# EAGLE design tester (EAGLE 6.4)
COPYRIGHT: based on Transistortester (microcontroller.net); PROJECT_INFO: +backlight-pwm +zener +relais; PROJECT_NAME: Component Tester
Assembly variants: nopwm
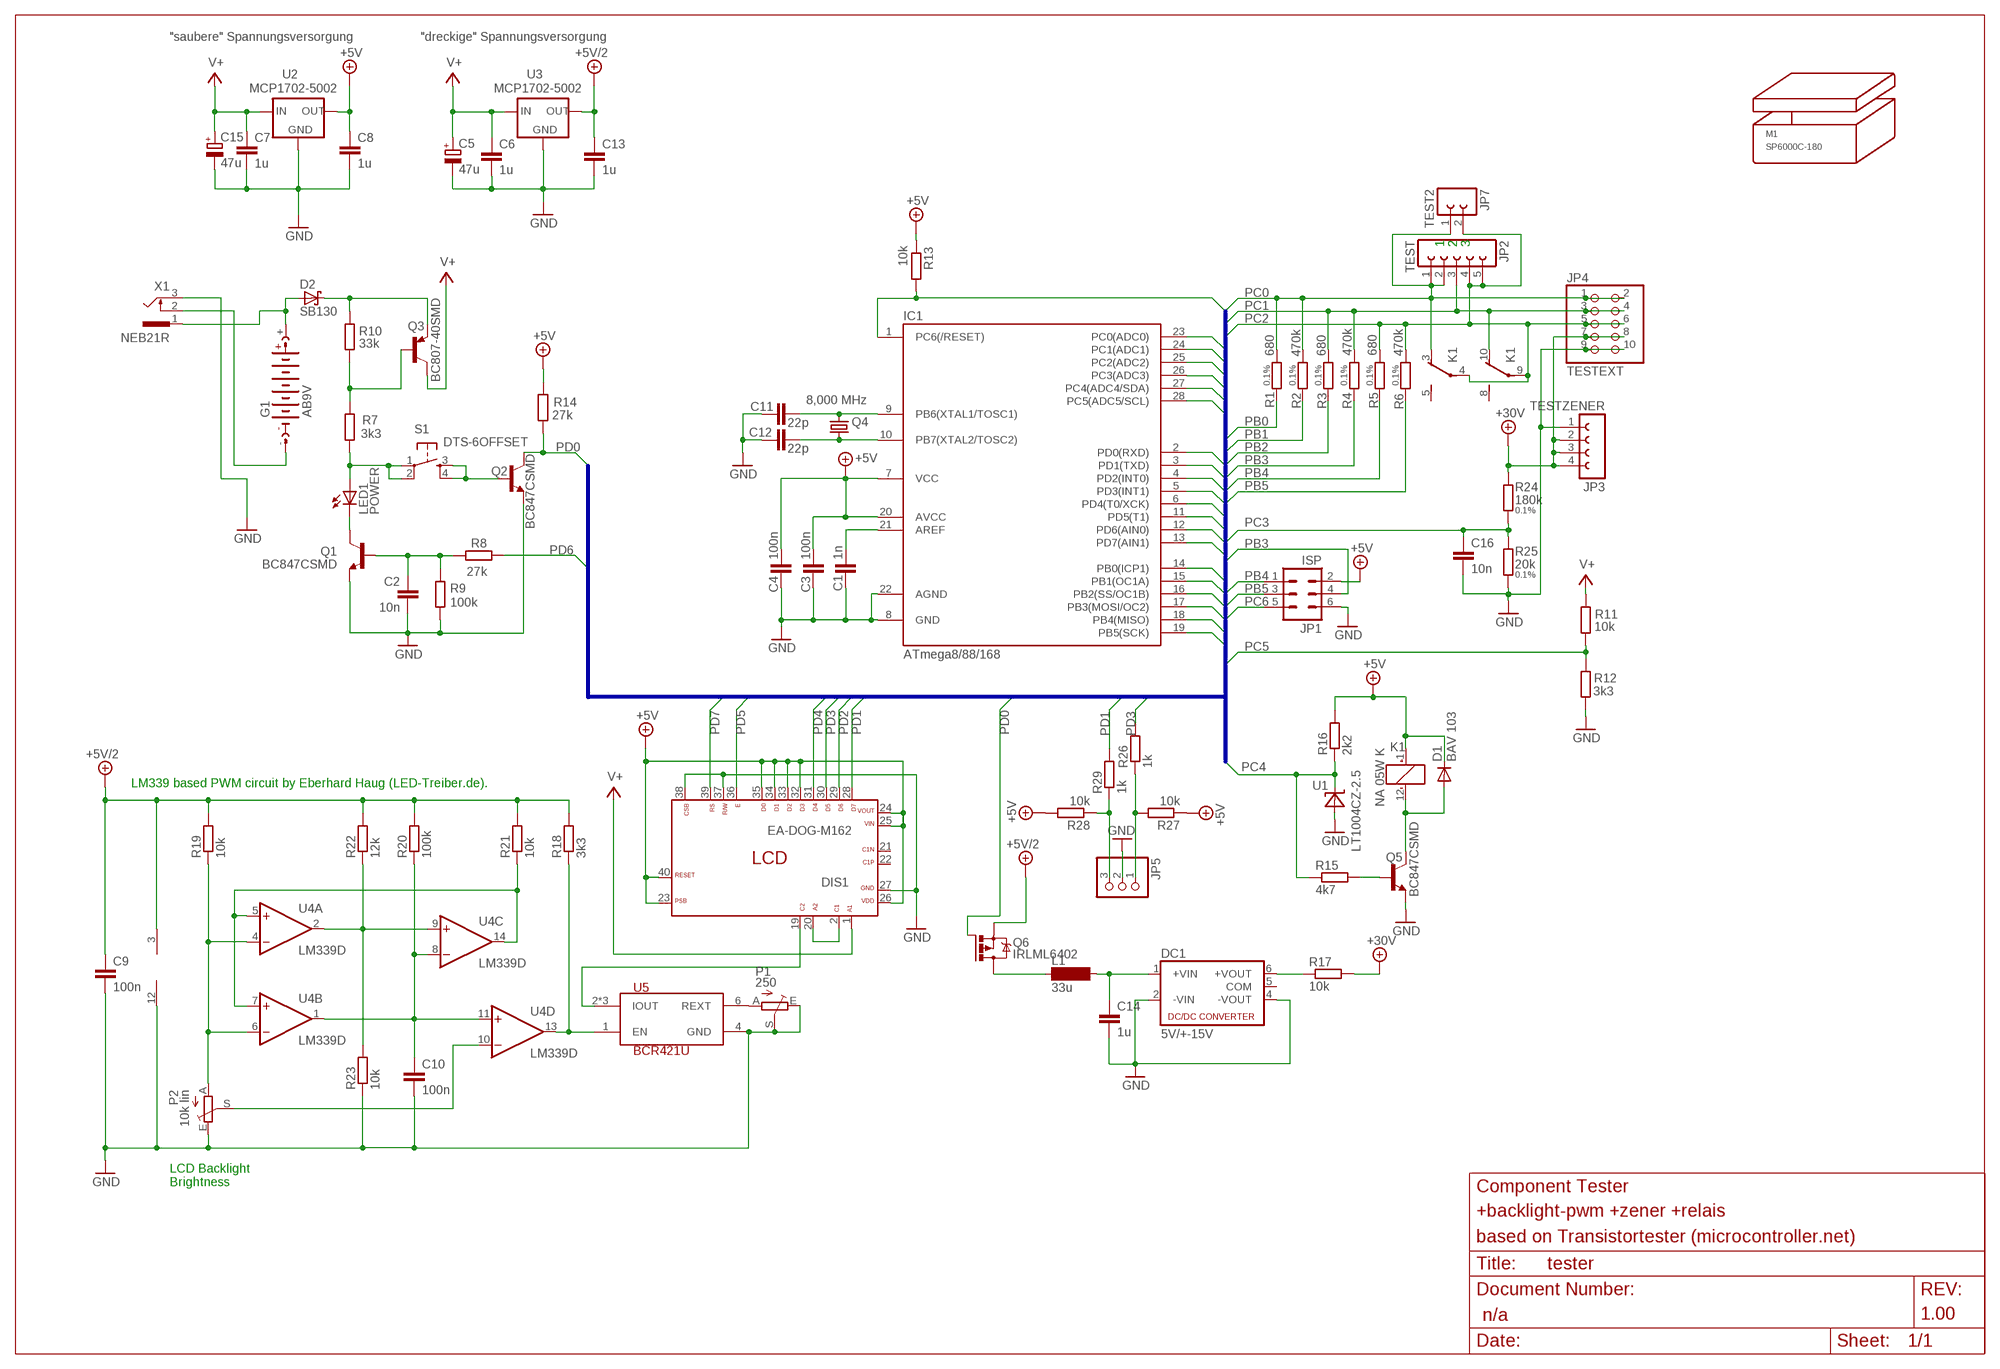
[diagram p0: schematic, sheet 1]
FRAME1 (FRAME_A3): DOCUMENT_ID: n/a; REVISION_ID: 1.00

## Parts
C1  1n  C-EUC0805  [C0805]
C2  10n  C-EUC0805  [C0805]
C3  100n  C-EUC0805  [C0805]
C4  100n  C-EUC0805  [C0805]
C5  47u  CPOL-EU153CLV-0505  [153CLV-0505]
C6  1u  C-EUC0805  [C0805]
C7  1u  C-EUC0805  [C0805]
C8  1u  C-EUC0805  [C0805]
C9  100n  C-EUC0805  [C0805]  (not fitted in variant nopwm)
C10  100n  C-EUC0805  [C0805]  (not fitted in variant nopwm)
C11  22p  C-EUC0805  [C0805]
C12  22p  C-EUC0805  [C0805]
C13  1u  C-EUC0805  [C0805]
C14  1u  C-EUC0805  [C0805]
C15  47u  CPOL-EU153CLV-0505  [153CLV-0505]
C16  10n  C-EUC0805  [C0805]
D1  BAV 103  DIODE-SOD80C  [SOD80C]
D2  SB130  SCHOTTKY-DIODE_RAD3-5-A  [DIODE-3-5A-V]
DC1  5V/+-15V  NMA  [NMA]
DIS1  EA-DOG-M162  EA-DOG-M_LCD  [EA_DOGM]
G1  AB9V  [AB9V]
IC1  ATmega8/88/168  MEGA8-PU  [DIL28-3]
JP1  ISP  ML6  [ML6]
JP2  TEST  FE05-1  [FE05-1]
JP3  TESTZENER  FE04-1  [FE04-1]
JP4  TESTEXT  PINHD-2X5  [2X05]
JP5  PINHD-1X3  [1X03]
JP7  TEST2  FE02-1  [FE02-1]
K1  NA 05W K  NA  [NA]
L1  33u  SM-NE29BIGGERPAD  [SM-NE29-B]
LED1  POWER  LED5MMEXT  [LED5MM]
M1  SP6000C-180  [SP6000C-180]
P1  250  TRIM_EU-CA6H  [CA6H]
P2  10k lin  TRIM_EU-CA9V  [CA9V]  (not fitted in variant nopwm)
Q1  BC847CSMD  [SOT23]
Q2  BC847CSMD  [SOT23]
Q3  BC807-40SMD  [SOT23-BEC]
Q4  8,000 MHz  CRYSTALHC49S  [HC49/S]
Q5  BC847CSMD  [SOT23]
Q6  IRLML6402  [MICRO3]
R1  680  R-EU_R0805  [R0805]
R2  470k  R-EU_R0805  [R0805]
R3  680  R-EU_R0805  [R0805]
R4  470k  R-EU_R0805  [R0805]
R5  680  R-EU_R0805  [R0805]
R6  470k  R-EU_R0805  [R0805]
R7  3k3  R-EU_R0805  [R0805]
R8  27k  R-EU_R0805  [R0805]
R9  100k  R-EU_R0805  [R0805]
R10  33k  R-EU_R0805  [R0805]
R11  10k  R-EU_R0805  [R0805]
R12  3k3  R-EU_R0805  [R0805]
R13  10k  R-EU_R0805  [R0805]
R14  27k  R-EU_R0805  [R0805]
R15  4k7  R-EU_R0805  [R0805]
R16  2k2  R-EU_R0805  [R0805]
R17  10k  R-EU_R0805  [R0805]
R18  3k3  R-EU_R0805  [R0805]
R19  10k  R-EU_R0805  [R0805]  (not fitted in variant nopwm)
R20  100k  R-EU_R0805  [R0805]  (not fitted in variant nopwm)
R21  10k  R-EU_R0805  [R0805]  (not fitted in variant nopwm)
R22  12k  R-EU_R0805  [R0805]  (not fitted in variant nopwm)
R23  10k  R-EU_R0805  [R0805]  (not fitted in variant nopwm)
R24  180k  R-EU_R0805  [R0805]
R25  20k  R-EU_R0805  [R0805]
R26  1k  R-EU_R0805  [R0805]
R27  10k  R-EU_R0805  [R0805]
R28  10k  R-EU_R0805  [R0805]
R29  1k  R-EU_R0805  [R0805]
S1  DTS-6OFFSET  [DTS-6S]
U1  LT1004CZ-2.5  LM329DZ  [TO92]
U2  MCP1702-5002  [TO92-LOWDROP]
U3  MCP1702-5002  [TO92-LOWDROP]
U4  LM339D  [SO14]  (not fitted in variant nopwm)
U5  BCR421U  BCR421UHAND  [SC74_INFINEON]
X1  NEB21R  [NEB21R]

## Nets
+5V: C3.2 C4.1 C8.1 D1.C DIS1.23 DIS1.24 DIS1.25 DIS1.26 DIS1.32 DIS1.33 DIS1.34 DIS1.35 DIS1.40 IC1.7(VCC) IC1.20(AVCC) JP1.2 K1.1(1:+) R13.1 R14.2 R16.2 R27.1 R28.2 U2.OUT
+5V/2: C9.1 C13.1 Q6.2(S) R18.2 R19.2 R20.2 R21.2 R22.2 U3.OUT U4.3(P:V+)
+30V: JP3.2 JP3.3 JP3.4 JP4.7 JP4.8 R17.2 R24.2
AREF: C1.2 IC1.21(AREF)
GND: C1.1 C2.2 C3.1 C4.2 C5.- C6.2 C7.2 C8.2 C9.2 C10.2 C11.1 C12.1 C13.2 C14.2 C15.- C16.2 DC1.2(-VIN) DC1.4(-VOUT) DIS1.27 DIS1.37 DIS1.38 IC1.8(GND) IC1.22(AGND) JP1.6 JP3.1 JP4.9 JP4.10 JP5.2 P1.E P1.S P2.E Q1.2(E) Q2.2(E) Q5.2(E) R9.1 R12.1 R23.1 R25.1 U1.1(A) U2.GND U3.GND U4.12(P:GND) U5.4(GND) X1.3
N$1: P1.A U5.6(REXT)
N$2: DIS1.2 DIS1.20
N$3: Q2.1(B) S1.3 S1.4
N$4: R22.1 R23.2 U4.2(A:OUT) U4.9(C:+IN)
N$5 [pwr]: G1.- X1.2
N$6: C10.1 R20.1 U4.1(B:OUT) U4.8(C:-IN) U4.11(D:+IN)
N$7: R21.1 U4.5(A:+IN) U4.7(B:+IN) U4.14(C:OUT)
N$8: LED1.K(C) Q1.3(C)
N$9 [pwr]: D2.C Q3.E R10.1
N$10: DIS1.19 U5.2(IOUT) U5.3(IOUT) U5.5(IOUT)
N$12: C11.2 IC1.9(PB6(XTAL1/TOSC1)) Q4.2
N$13: C12.2 IC1.10(PB7(XTAL2/TOSC2)) Q4.1
N$14: JP5.3 R28.1 R29.1
N$15: P2.A R19.1 U4.4(A:-IN) U4.6(B:-IN)
N$16: P2.S U4.10(D:-IN)
N$17: R18.1 U4.13(D:OUT) U5.1(EN)
N$18: D1.A K1.12(1:-) Q5.3(C)
N$19: JP5.1 R26.1 R27.2
N$21: LED1.A R7.1 S1.1 S1.2
N$22: Q5.1(B) R15.2
N$23 [pwr]: D2.A G1.+ X1.1
N$24: L1.1 Q6.3(D)
N$25: C14.1 DC1.1(+VIN) L1.2
N$28: DC1.6(+VOUT) R17.1
N$33: Q3.B R7.2 R10.2
N$35: C2.1 Q1.1(B) R8.2 R9.2
PB0: IC1.14(PB0(ICP1)) R1.1
PB1: IC1.15(PB1(OC1A)) R2.1
PB2: IC1.16(PB2(SS/OC1B)) R3.1
PB3: IC1.17(PB3(MOSI/OC2)) JP1.4 R4.1
PB4: IC1.18(PB4(MISO)) JP1.1 R5.1
PB5: IC1.19(PB5(SCK)) JP1.3 R6.1
PC0: IC1.23(PC0(ADC0)) JP2.1 JP2.2 JP4.1 JP4.2 JP7.1 K1.3(2:O) R1.2 R2.2
PC1: IC1.24(PC1(ADC1)) JP2.3 JP4.3 JP4.4 K1.10(3:O) R3.2 R4.2
PC2: IC1.25(PC2(ADC2)) JP2.4 JP2.5 JP4.5 JP4.6 JP7.2 K1.4(2:P) K1.9(3:P) R5.2 R6.2
PC3: C16.1 IC1.26(PC3(ADC3)) R24.1 R25.2
PC4: IC1.27(PC4(ADC4/SDA)) R15.1 R16.1 U1.2(C)
PC5: IC1.28(PC5(ADC5/SCL)) R11.2 R12.2
PC6: IC1.1(PC6(/RESET)) JP1.5 R13.2
PD0: IC1.2(PD0(RXD)) Q2.3(C) Q6.1(G) R14.1
PD1: DIS1.28 IC1.3(PD1(TXD)) R29.2
PD2: DIS1.29 IC1.4(PD2(INT0))
PD3: DIS1.30 IC1.5(PD3(INT1)) R26.2
PD4: DIS1.31 IC1.6(PD4(T0/XCK))
PD5: DIS1.36 IC1.11(PD5(T1))
PD6: IC1.12(PD6(AIN0)) R8.1
PD7: DIS1.39 IC1.13(PD7(AIN1))
V+ [pwr]: C5.+ C6.1 C7.1 C15.+ DIS1.1 Q3.C R11.1 U2.IN U3.IN
Unconnected: DC1.5(COM) DIS1.21 DIS1.22 K1.5(2:S) K1.8(3:S)

## Buses
BUS1:PB[0..5],PC[0..6],PD[0..7]

## Notes on the sheet
- "saubere" Spannungsversorgung | "dreckige" Spannungsversorgung
- 1 | 2 | 3
- LM339 based PWM circuit by Eberhard Haug (LED-Treiber.de).
- LCD Backlight
  Brightness

## Library data of the parts
C1-C4 C6-C14 C16 = rcl:C-EU: CAPACITOR, European symbol
C5 C15 = rcl:CPOL-EU: POLARIZED CAPACITOR, European symbol
D1 = diode:DIODE-: DIODE
D2 = markus:SCHOTTKY-DIODE: Schottky Diode
DC1 = dc-dc-converter:NMA: DC-DC CONVERTER; MF: C & D TECHNOLOGIES, INC; MPN: NMA0515SC; OC_FARNELL: 1021434; OC_NEWARK: 61K3064
DIS1 = ea:EA-DOG-M_LCD
G1 = battery:AB9V: 9-V BATTERY CLIP
IC1 = avr-7:MEGA8-PU
JP1 = con-ml:ML6: HARTING; OC_FARNELL: unknown; OC_NEWARK: unknown
JP2 = con-lsta:FE05-1: FEMALE HEADER; OC_FARNELL: unknown; OC_NEWARK: unknown
JP3 = con-lsta:FE04-1: FEMALE HEADER
JP4 = pinhead:PINHD-2X5: PIN HEADER; REICHELT: AW 226/20
JP5 = pinhead:PINHD-1X3: PIN HEADER
JP7 = con-lsta:FE02-1: FEMALE HEADER
K1 = relay:NA: RELAY; OC_FARNELL: unknown; OC_NEWARK: unknown
L1 = inductor-neosid:SM-NE29: INDUCTOR SMD chip inductor
LED1 = led:LED: LED OSRAM: - CHIPLED LG R971, LG N971, LY N971, LG Q971, LY Q971, LO R971, LY R971 LH N974, LH R974 LS Q976, LO Q976, LY Q976 LO Q996 - Hyper CHIPLED LW Q18S LB Q993, LB Q99A, LB R99A - SideLED LS A670, LO A670, LY A670, LG A670, LP A670 LB A673, LV A673, LT A673, LW A673 LH A674 LY A675 LS A676, LA A676, LO A676, LY A676, LW A676 LS A679, LY A679, LG A679 - Hyper Micro SIDELED® LS Y876, LA Y876, LO Y876, LY Y876 LT Y87S - SmartLED LW L88C, LW L88S LB L89C, LB L89S, LG L890 LS L89K, LO L89K, LY L89K LS L896, LA L896, LO L896, LY L896 - TOPLED LS T670, LO T670, LY T670, LG T670, LP T670 LSG T670, LSP T670, LSY T670, LOP T670, LYG T670 LG T671, LOG T671, LSG T671 LB T673, LV T673, LT T673, LW T673 LH T674 LS T676, LA T676, LO T676, LY T676, LB T676, LH T676, LSB T676, LW T676 LB T67C, LV T67C, LT T67C, LS T67K, LO T67K, LY T67K, LW E67C LS E67B, LA E67B, LO E67B, LY E67B, LB E67C, LV E67C, LT E67C LW T67C LS T679, LY T679, LG T679 LS T770, LO T770, LY T770, LG T770, LP T770 LB T773, LV T773, LT T773, LW T773 LH T774 LS E675, LA E675, LY E675, LS T675 LS T776, LA T776, LO T776, LY T776, LB T776 LHGB T686 LT T68C, LB T68C - Hyper Mini TOPLED® LB M676 - Mini TOPLED Santana® LG M470 LS M47K, LO M47K, LY M47K Source: http://www.osram.convergy.de LUXEON: - LUMILED® LXK2-PW12-R00, LXK2-PW12-S00, LXK2-PW14-U00, LXK2-PW14-V00 LXK2-PM12-R00, LXK2-PM12-S00, LXK2-PM14-U00 LXK2-PE12-Q00, LXK2-PE12-R00, LXK2-PE12-S00, LXK2-PE14-T00, LXK2-PE14-U00 LXK2-PB12-K00, LXK2-PB12-L00, LXK2-PB12-M00, LXK2-PB14-N00, LXK2-PB14-P00, LXK2-PB14-Q00 LXK2-PR12-L00, LXK2-PR12-M00, LXK2-PR14-Q00, LXK2-PR14-R00 LXK2-PD12-Q00, LXK2-PD12-R00, LXK2-PD12-S00 LXK2-PH12-R00, LXK2-PH12-S00 LXK2-PL12-P00, LXK2-PL12-Q00, LXK2-PL12-R00 Source: www.luxeon.com KINGBRIGHT: KA-3528ASYC Source: www.kingbright.com; _EXTERNAL_: ext. package
M1 = strapubox:SP6000: Gehäuse Strapubox Typ 6000 max. Bauteilhöhe, top-layer: 15,5 mm max. Bauteilhöhe, bottom-layer: 5 mm (Dicke der LP: 1,5 mm) Außenmaße: Länge: 103 mm Breite: 62 mm Höhe: 26 mm Innenmaße: Länge: 97 mm Breite: 56 mm Höhe: 22 mm Mit Batteriefach 2xAA/9V
P1 P2 = pot:TRIM_EU-: POTENTIOMETER
Q1 Q2 Q5 = transistor-npn:BC847*: NPN Transistor
Q3 = transistor-pnp:BC807*: PNP Transistror
Q4 = crystal:CRYSTAL: CRYSTAL; OC_FARNELL: 1667008; OC_NEWARK: unknown
Q6 = mosfet:IRLML6402: HEXFET P-Channel Power MOSFET http://www.irf.com/product-info/datasheets/data/irlml6402.pdf
R1-R6 R24 R25 = resistor:R-EU_: RESISTOR, European symbol; TOLERANCE: 0.1%
R7-R23 R26-R29 = resistor:R-EU_: RESISTOR, European symbol
S1 = switch-tact:DTS-6
U1 = reference:LM329*: National Semiconductor LM329 6.8V buried zener voltage reference
U2 U3 = asko:MCP1702-5002
U4 = linear:LM339: Low Power Low Offset Voltage Quad Comparators with open collector; LM139/LM239/LM339/LM2901/LM3302
U5 = c-infineon_v2:BCR421U: Constant current source: 10mA (without external resistor).
X1 = con-lumberg:NEB21R: Netzgeräte-Einbaukupplung abgewinkelte Ausführung mit Öffner Source: http://www.lumberg.com/Produkte/PDFs/NEB21R.pdf; MPN: NEB 21 R; OC_FARNELL: 1217037; OC_NEWARK: 97K6458

## Net classes
0 default: width 0.25 mm, drill 0.3 mm
1 pwr: width 0.406 mm

## Board
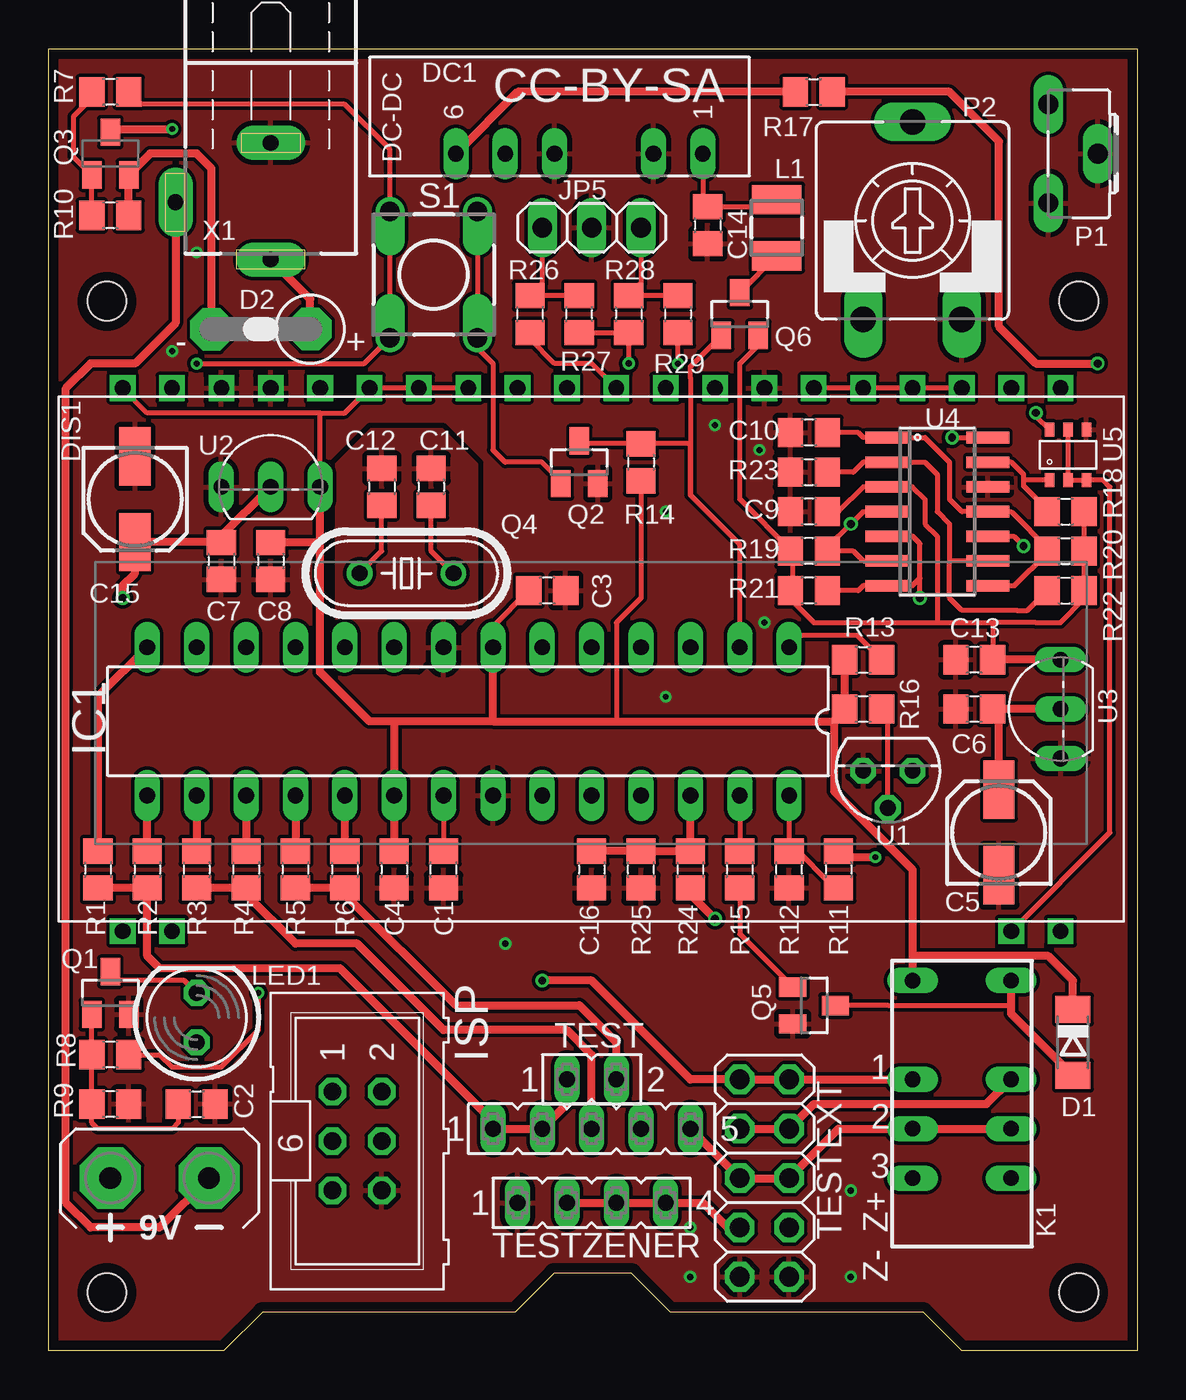
[diagram p1: board, top side]
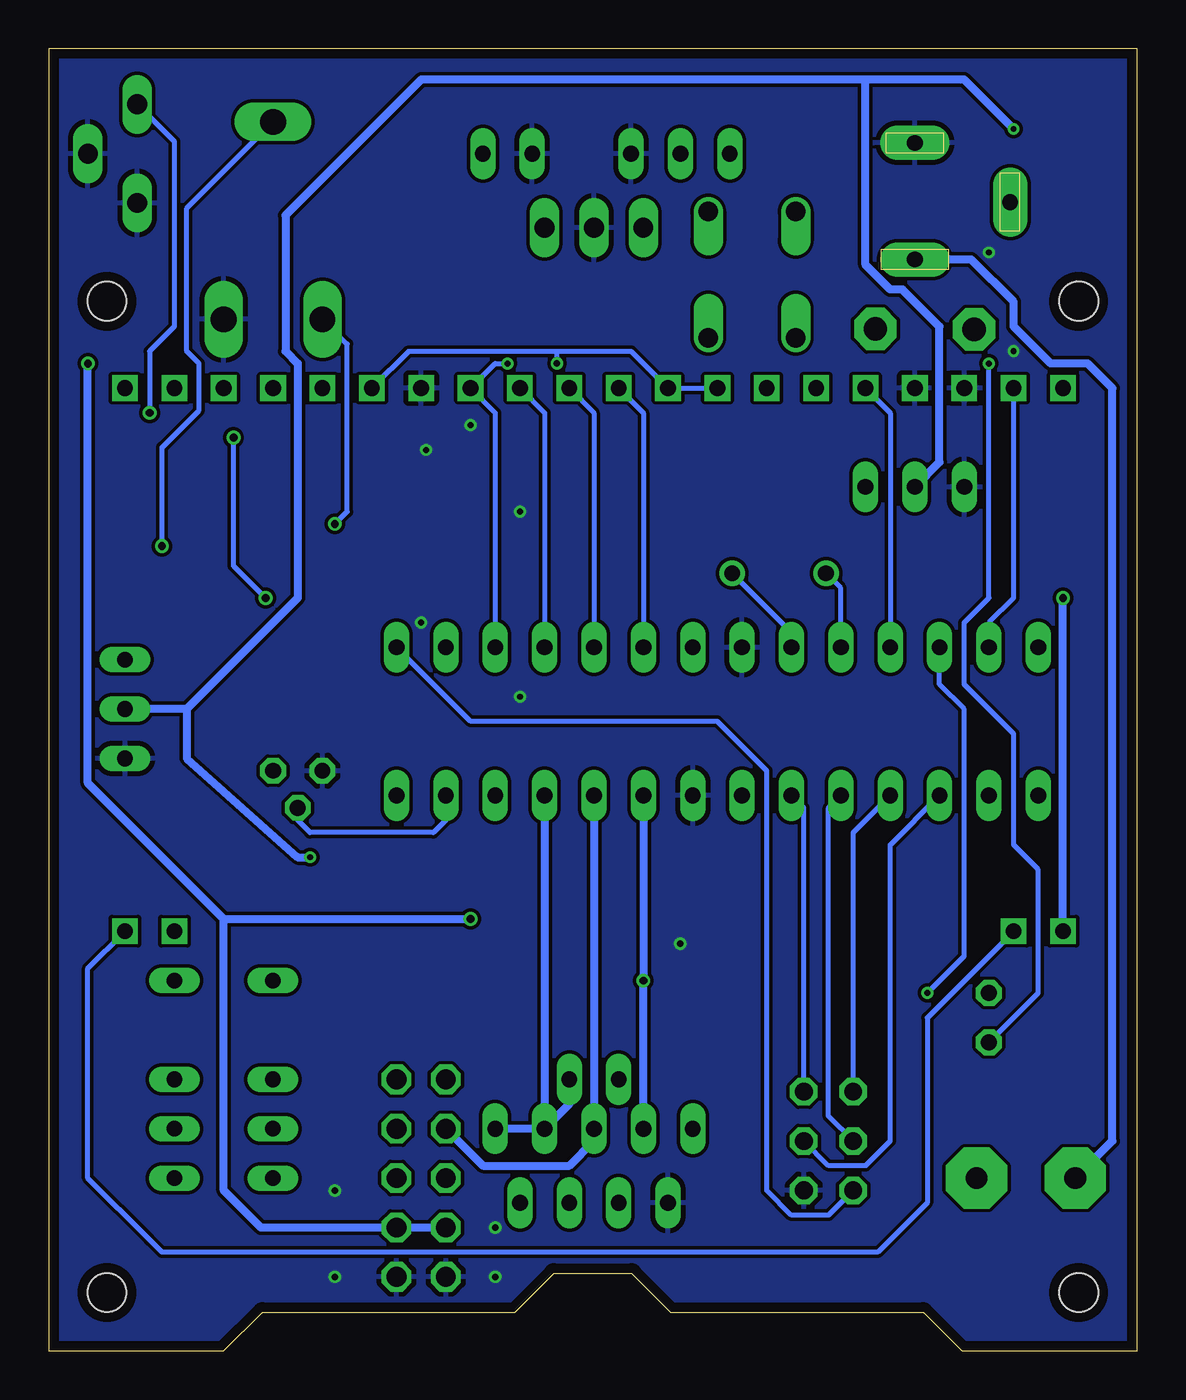
[diagram p2: board, bottom side, seen from below]

Size 56 x 67 mm. Coordinates in mm from the lower left corner, seen from the top.
Copper layers (1*16): Top 0.035mm / dielectric 1.5mm / Bottom 0.035mm
Design rules "smart-prototyping": minimum track width 7mil, minimum drill 12mil, track to track 7mil, track to pad 7mil, pad to pad 7mil, via to via 7mil, smd to smd 0mil, copper to edge 20mil, drill to drill 10mil, minimum pad ring 10mil, minimum via ring 6mil, stop-mask expansion 2mil, vias tented up to drill 25mil, thermal gap 10mil
tRestrict: area 52.8,46.9 to 53.1,47.7; area 51.8,47.8 to 53.2,47.9; area 50.7,44.3 to 54.4,44.4; area 51.1,45.2 to 52.2,45.3; area 52.7,45.2 to 53.9,45.3; 8 lines

### Footprints (pad centres in the part's own frame; a part is rotated, then mirrored left to right if it is on the bottom)
C0805 = smd 1.3 x 1.5: 1 -0.95,0; 2 0.95,0
153CLV-0505 = smd 3 x 1.6: + 2.2,0; - -2.2,0
SOD80C = smd 1.4 x 1.8: A 1.7,0; C -1.7,0
DIODE-3-5A-V = drill 1.2 pad 2.184 octagon: A -2.54,0; C 2.54,0.025
NMA = drill 0.813 long: 1 0,6.35; 2 0,3.81; 4 0,-1.27; 5 0,-3.81; 6 0,-6.35
EA_DOGM = drill 0.813 square: 1 0,0; 2 2.54,0; 19 45.72,0; 20 48.26,0; 21 48.26,27.94; 22 45.72,27.94; 23 43.18,27.94; 24 40.64,27.94; 25 38.1,27.94; 26 35.56,27.94; 27 33.02,27.94; 28 30.48,27.94; 29 27.94,27.94; 30 25.4,27.94; 31 22.86,27.94; 32 20.32,27.94; 33 17.78,27.94; 34 15.24,27.94; 35 12.7,27.94; 36 10.16,27.94; 37 7.62,27.94; 38 5.08,27.94; 39 2.54,27.94; 40 0,27.94
AB9V = drill 1.118 pad 3.15 octagon: + 0,2.54; - 0,-2.54
DIL28-3 = drill 0.813 long: 1 -16.51,-3.81; 2 -13.97,-3.81; 3 -11.43,-3.81; 4 -8.89,-3.81; 5 -6.35,-3.81; 6 -3.81,-3.81; 7 -1.27,-3.81; 8 1.27,-3.81; 9 3.81,-3.81; 10 6.35,-3.81; 11 8.89,-3.81; 12 11.43,-3.81; 13 13.97,-3.81; 14 16.51,-3.81; 15 16.51,3.81; 16 13.97,3.81; 17 11.43,3.81; 18 8.89,3.81; 19 6.35,3.81; 20 3.81,3.81; 21 1.27,3.81; 22 -1.27,3.81; 23 -3.81,3.81; 24 -6.35,3.81; 25 -8.89,3.81; 26 -11.43,3.81; 27 -13.97,3.81; 28 -16.51,3.81
ML6 = drill 0.914 octagon: 1 -2.54,-1.27; 2 -2.54,1.27; 3 0,-1.27; 4 0,1.27; 5 2.54,-1.27; 6 2.54,1.27
FE05-1 = drill 0.813 long: 1 -5.08,0; 2 -2.54,0; 3 0,0; 4 2.54,0; 5 5.08,0
FE04-1 = drill 0.813 long: 1 -3.81,0; 2 -1.27,0; 3 1.27,0; 4 3.81,0
2X05 = drill 1.016 octagon: 1 -5.08,-1.27; 2 -5.08,1.27; 3 -2.54,-1.27; 4 -2.54,1.27; 5 0,-1.27; 6 0,1.27; 7 2.54,-1.27; 8 2.54,1.27; 9 5.08,-1.27; 10 5.08,1.27
1X03 = drill 1.016 long: 1 -2.54,0; 2 0,0; 3 2.54,0
FE02-1 = drill 0.813 long: 1 -1.27,0; 2 1.27,0
NA = drill 0.8 long: 1 -6.35,-2.54; 3 -1.27,-2.54; 4 1.27,-2.54; 5 3.81,-2.54; 8 3.81,2.54; 9 1.27,2.54; 10 -1.27,2.54; 12 -6.35,2.54
SM-NE29-B = smd 1.5 x 2.54: 1 -1.45,0; 2 1.45,0
LED5MM = drill 0.813 octagon: A -1.27,0; K 1.27,0
SP6000C-180 = hole 2: 3,54; 53,54; 3,3; 53,3
CA6H = drill 1.016 long: A -2.54,0; E 2.54,0; S 0,2.54
CA9V = drill 1.321 long: A -2.54,-5.08; E 2.54,-5.08; S 0,5.08
SOT23 = smd 1 x 1.4: 1 -0.95,-1.1; 2 0.95,-1.1; 3 0,1.1
SOT23-BEC = smd 1 x 1.4: B -0.95,-1.1; C 0,1.1; E 0.95,-1.1
HC49/S = drill 0.813: 1 -2.413,0; 2 2.413,0
MICRO3 = smd 1 x 1.4: 1 -0.95,-1.1; 2 0.95,-1.1; 3 0,1.1
R0805 = smd 1.3 x 1.5: 1 -0.95,0; 2 0.95,0
DTS-6S = drill 1 offset: 1 -3.25,2.25; 2 3.25,2.25; 3 -3.25,-2.25; 4 3.25,-2.25
TO92 = drill 0.813 octagon: 1 1.27,0; 2 0,1.905; 3 -1.27,0
TO92-LOWDROP = drill 0.813 long: GND -3.81,0; IN -1.27,0; OUT 1.27,0
SO14 = smd 0.6 x 2.2: 1 -3.81,-2.6; 2 -2.54,-2.6; 3 -1.27,-2.6; 4 0,-2.6; 5 1.27,-2.6; 6 2.54,-2.6; 7 3.81,-2.6; 8 3.81,2.6; 9 2.54,2.6; 10 1.27,2.6; 11 0,2.6; 12 -1.27,2.6; 13 -2.54,2.6; 14 -3.81,2.6
SC74_INFINEON = smd 0.5 x 0.7: 1 -0.95,-1.3; 2 0,-1.3; 3 0.95,-1.3; 4 0.95,1.3; 5 0,1.3; 6 -0.95,1.3
NEB21R = drill 0.813 pad 1.778 long: 1 0,7.35; 2 4.9,4.4; 3 0,1.35

### Placement (x,y rotation side)
C1  20.32,24.77 90 top
C2  7.62,12.7 0 top
C3  25.65,39.12 180 top
C4  17.78,24.77 270 top
C5  48.9,26.67 90 top
C6  47.62,33.02 180 top
C7  8.89,40.64 270 top
C8  11.43,40.64 270 top
C9  39.12,43.18 180 top
C10  39.12,47.24 180 top
C11  19.68,44.45 270 top
C12  17.14,44.45 270 top
C13  47.62,35.56 180 top
C14  33.91,57.91 270 top
C15  4.45,43.81 270 top
C16  27.94,24.77 270 top
D1  52.7,15.88 270 top
D2  10.92,52.58 180 top
DC1  27.3,61.59 270 top
DIS1  3.81,21.59 0 top
G1  5.71,8.89 90 top
IC1  21.59,32.38 180 top
JP1  15.88,10.79 270 top
JP2  27.94,11.43 0 top
JP3  27.94,7.62 0 top
JP4  36.83,8.89 270 top
JP5  27.94,57.78 0 top
JP7  27.94,13.97 0 top
K1  46.99,12.7 270 top
L1  37.47,57.78 90 top
LED1  7.62,17.14 90 top
M1  0,0 0 top
P1  51.44,61.59 270 top
P2  44.45,58.15 0 top
Q1  3.17,18.41 0 top
Q2  27.3,45.72 0 top
Q3  3.17,61.59 0 top
Q4  18.41,40.01 0 top
Q5  39.39,17.77 270 top
Q6  35.56,53.34 0 top
R1  2.54,24.77 270 top
R2  5.08,24.77 270 top
R3  7.62,24.77 270 top
R4  10.16,24.77 270 top
R5  12.7,24.77 270 top
R6  15.24,24.77 270 top
R7  3.17,64.77 180 top
R8  3.17,15.24 180 top
R9  3.17,12.7 180 top
R10  3.17,58.42 180 top
R11  40.64,24.77 270 top
R12  38.1,24.77 90 top
R13  41.91,35.56 0 top
R14  30.48,45.72 270 top
R15  35.56,24.77 270 top
R16  41.91,33.02 180 top
R17  39.37,64.77 0 top
R18  52.32,43.18 0 top
R19  39.12,41.15 180 top
R20  52.32,41.15 0 top
R21  39.12,39.12 180 top
R22  52.32,39.12 0 top
R23  39.12,45.21 0 top
R24  33.02,24.77 270 top
R25  30.48,24.77 90 top
R26  24.77,53.34 270 top
R27  27.3,53.34 90 top
R28  29.84,53.34 270 top
R29  32.38,53.34 270 top
S1  19.81,55.37 90 top
U1  43.18,29.84 180 top
U2  12.7,44.45 0 top
U3  52.07,34.29 90 top
U4  45.72,43.18 270 top
U5  52.45,46.1 0 top
X1  11.43,63.5 180 top

### Tracks (layer width: path | path; a pad name or v marks a point on that pad's centre or on a via)
+5V  (via drill 0.33)
  Top 0.25: 40.42,32.38 40.42,32.48 R16.2 | 22.86,37.17 22.86,37.27 C3.2 | R27.1 R28.2 v29.84,50.8
  Top 0.254: DIS1.23 DIS1.24 DIS1.25 DIS1.26 | DIS1.33 DIS1.34 DIS1.35 15.24,48.26 13.97,48.26 | U2.OUT 13.97,48.26 | 13.97,48.26 5.08,48.26 DIS1.40 | R14.2 30.48,38.73 29.21,37.47 29.21,32.38 | IC1.7 22.86,37.17
  Top 0.406: 22.86,32.38 17.78,32.38 | 17.78,32.38 16.51,32.38 13.97,34.92 13.97,41.59 | 22.86,32.38 IC1.7 | 17.78,32.38 IC1.20 C4.1 | 44.45,20.32 44.45,24.77 40.42,28.79 40.42,32.38 29.21,32.38 22.86,32.38 | 44.45,20.32 K1.1 | D1.C 52.7,19.05 51.44,20.32 44.45,20.32 | R16.2 R13.1 | 13.97,41.59 U2.OUT | 13.97,41.59 C8.1
  Bottom 0.25: v29.84,50.8 29.84,51.44
  Bottom 0.254: DIS1.33 DIS1.32 26.04,51.44 29.84,51.44 37.47,51.44 DIS1.26 | JP1.2 17.14,27.94 IC1.20
+5V/2
  Top 0.25: 50.8,37.47 52.07,37.47 53.27,38.67 R22.2 | 38.27,41.11 38.27,39.22 R21.2 38.27,39.02 38.27,38.57 | 35.56,50.42 35.56,50.8 36.51,51.75 Q6.2
  Top 0.254: C9.1 40.64,43.18 41.91,44.45 U4.3 44.45,44.45 45.09,43.81 45.09,42.55 45.72,41.91 45.72,37.47 | R18.2 R20.2 R22.2 | 38.23,41.15 35.56,43.81 35.56,50.42 | 45.72,37.47 39.37,37.47 38.27,38.57 | 45.72,37.47 48.58,37.47 | 48.58,37.47 C13.1 | 50.8,37.47 48.58,37.47
  Top 0.406: R22.2 53.25,39.12 53.34,39.2 | R19.2 38.23,41.15 38.27,41.11 | U3.OUT C13.1
+30V  (via drill 0.4)
  Top 0.406: JP3.2 JP3.3 JP3.4 33.66,7.62 34.92,6.35 JP4.7 | v53.98,50.8 50.8,50.8 48.9,52.7 48.9,62.23 46.35,64.77 R17.2 | v34.29,22.23 33.02,23.5 R24.2
  Bottom 0.406: v53.98,50.8 53.98,29.21 46.99,22.23 | 46.99,22.23 46.99,8.26 45.09,6.35 JP4.8 JP4.7 | 46.99,22.23 v34.29,22.23
AREF
  Top 0.254: IC1.21 C1.2
GND  (via drill 0.3, 0.33)
  other vias: 41.27,8.26 41.27,3.81 33.02,6.35 33.02,3.81 23.5,20.95 31.75,43.18 31.75,33.66 34.29,47.62 36.83,37.47 7.62,56.52 6.35,51.44 36.58,46.35
  pour Top (rank 2): -1.27,67.31 57.15,67.31 57.15,-1.27 -1.27,-1.27
  pour Bottom (rank 2): -2.54,68.58 58.42,68.58 58.42,-2.54 -2.54,-2.54
N$1  (via drill 0.4)
  Top 0.254: U5.6 51.47,47.37 51.44,47.37 | 51.44,47.34 U5.6 | v50.8,48.26 50.8,48.1 U5.6
  Bottom 0.254: P1.A 49.53,62.23 49.53,52.7 50.8,51.44 v50.8,48.26
N$2
  Bottom 0.254: DIS1.2 10.79,17.14 10.79,7.62 13.34,5.08 50.16,5.08 50.8,5.71 53.98,8.89 53.98,19.68 DIS1.20
N$3
  Top 0.25: 23.5,45.72 22.86,46.35 22.86,50.8 22.06,51.6 S1.3 S1.4
  Top 0.254: 23.5,45.72 25.4,45.72 26.36,44.77 Q2.1
N$4
  Top 0.25: 49.82,38.1 50.36,38.1 R22.1
  Top 0.254: 46.35,40.64 46.35,42.55 45.72,43.18 45.72,45.09 45.09,45.72 U4.2 41.91,45.72 41.4,45.21 R23.2 | U4.9 46.35,40.64 | 49.82,38.1 46.99,38.1 46.35,38.73 46.35,40.64
N$5
  Top 0.406: G1.- 5.71,6.35 2.16,6.35 0.89,7.62 0.89,49.53 2.16,50.8 4.45,50.8 6.53,52.88 X1.2
N$6
  Top 0.25: 49.7,39.37 51.37,41.05 R20.1 51.47,41.15 51.47,41.24
  Top 0.254: C10.1 41.66,47.24 41.91,46.99 U4.1 45.09,46.99 46.35,45.72 46.35,43.81 46.99,43.18 U4.11 49.53,43.18 51.47,41.24 | U4.8 49.7,39.37
N$7  (via drill 0.4)
  Top 0.254: 44.83,39.75 44.45,39.37 U4.7 41.91,39.37 41.66,39.12 R21.1 | 44.83,39.75 44.83,41.53 44.45,41.91 U4.5 | v46.48,46.99 U4.14 | v44.83,38.73 44.83,39.75
  Bottom 0.254: v46.48,46.99 46.48,40.39 v44.83,38.73
N$8
  Top 0.25: LED1.K 6.99,19.05 3.17,19.05 Q1.3
N$9
  Top 0.406: 3.81,58.42 R10.1 Q3.E 5.22,61.59 7.62,61.59 8.38,60.83 D2.C
N$10
  Top 0.254: U5.5 U5.2 U5.3 54.26,44.8 54.61,44.45 54.61,26.67 DIS1.19
N$12
  Top 0.254: Q4.2 19.68,41.15 C11.2
  Bottom 0.254: IC1.9 17.78,36.96 Q4.2
N$13
  Top 0.254: Q4.1 17.14,41.15 C12.2
  Bottom 0.254: IC1.10 15.24,39.24 Q4.1
N$14
  Top 0.25: JP5.3 30.48,54.92 R28.1 R29.1
N$15  (via drill 0.4)
  Top 0.25: R19.1 40.07,41.21 40.01,41.27
  Top 0.254: U4.4 41.91,43.18 v41.27,42.55 40.01,41.27 39.97,41.24 | U4.6 41.91,40.64 41.4,41.15 R19.1
  Bottom 0.254: v41.27,42.55 40.64,43.18 40.64,51.8 P2.A
N$16  (via drill 0.4)
  Top 0.254: U4.10 49.66,41.91 v50.16,41.4
  Bottom 0.254: v50.16,41.4 50.16,46.48 48.26,48.39 48.26,50.8 48.9,51.44 48.9,58.78 P2.S
N$17
  Top 0.25: 50.16,44.49 51.37,43.28 R18.1
  Top 0.254: 50.16,44.49 50.16,44.8 | U4.13 49.53,45.72 50.16,45.09 50.16,44.8 | U5.1 50.16,44.8
N$18
  Top 0.25: 43.18,17.78 41.75,17.78 Q5.3
  Top 0.254: 43.18,17.78 49.53,17.78
  Top 0.406: D1.A 49.53,17.35 49.53,17.78 K1.12
N$19
  Top 0.25: JP5.1 25.4,54.92 R26.1 R27.2
N$21  (via drill 0.3)
  Top 0.25: R7.1 4.76,64.14 15.24,64.14 17.56,61.81 S1.2 S1.1 16.24,50.8 v7.62,50.8
  Bottom 0.25: LED1.A 5.08,18.41 5.08,24.77 6.35,26.04 6.35,31.75 8.89,34.29 8.89,37.47 7.62,38.73 v7.62,50.8
N$22
  Top 0.25: 35.56,22.1 35.56,21.45 Q5.1
  Top 0.254: R15.2 35.56,22.1
N$23
  Top 0.406: D2.A 13.46,54.12 X1.1
  Bottom 0.406: G1.+ 1.27,10.79 1.27,49.53 2.54,50.8 4.45,50.8 6.35,52.7 6.35,53.98 8.53,56.15 X1.1
N$24
  Top 0.25: L1.1 37.45,56.34 Q6.3
N$25
  Top 0.25: DC1.1 33.66,59.12 C14.1 37.09,58.86 L1.2
N$28
  Top 0.406: R17.1 24.13,64.77 DC1.6
N$33
  Top 0.25: R7.2 2.23,64.45 1.27,63.5 1.27,61.45 Q3.B
  Top 0.254: 2.33,60.4 Q3.B R10.2
N$35
  Top 0.25: 2.54,11.43 2.23,11.74 R9.2 R8.2 Q1.1
  Top 0.254: C2.1 6.67,11.75 6.35,11.43 2.54,11.43
PB0
  Top 0.406: IC1.14 2.54,33.66 R1.1
PB1
  Top 0.406: R2.1 IC1.15
PB2
  Top 0.406: IC1.16 R3.1
PB3
  Top 0.406: IC1.17 R4.1
  Bottom 0.254: JP1.4 15.88,9.53 13.97,9.53 12.7,10.79 12.7,26.04 IC1.17
PB4
  Top 0.406: IC1.18 R5.1
  Bottom 0.254: JP1.1 14.61,26.67 IC1.18
PB5
  Top 0.406: IC1.19 R6.1
  Bottom 0.254: JP1.3 15.88,12.06 15.88,27.94 IC1.19
PC0  (via drill 0.4)
  Top 0.406: K1.3 JP4.2 JP4.1 33.02,13.97 27.94,19.05 v25.4,19.05 | R2.2 R1.2 | JP7.1 26.67,12.7 JP2.2 JP2.1 22.86,11.81 14.99,19.68 5.71,19.68 5.08,20.32 R2.2 | 5.08,24.13 R2.2
  Bottom 0.406: IC1.23 v25.4,19.05 JP2.2
PC1
  Top 0.25: 10.16,23.5 R4.2
  Top 0.406: R4.2 R3.2 | K1.10 48.26,12.7 39.37,12.7 JP4.4 JP4.3 | JP2.3 27.94,15.24 26.67,16.51 20.32,16.51 15.88,20.95 12.7,20.95 10.16,23.5
  Bottom 0.406: IC1.24 JP2.3 27.94,10.79 29.21,9.53 33.66,9.53 JP4.3
PC2
  Top 0.406: R5.2 R6.2 15.24,23.5 20.95,17.78 27.3,17.78 29.21,15.88 JP7.2 | JP2.5 JP4.5 JP4.6 40.64,11.43 K1.4 K1.9
  Bottom 0.406: JP2.4 JP2.5 | IC1.25 JP2.4 | JP2.4 29.21,12.7 JP7.2
PC3
  Top 0.406: IC1.26 R24.1 R25.2 C16.1
PC4
  Top 0.25: 43.18,32.6 43.18,32.7 R16.1
  Top 0.254: IC1.27 R15.1 | U1.2 43.18,32.6
  Bottom 0.254: IC1.27 35.56,27.3 36.2,26.67 42.55,26.67 43.18,27.3 U1.2
PC5
  Top 0.25: IC1.28 R12.2 38.55,25.71 40.13,24.13 40.33,24.13 R11.2
PC6
  Top 0.254: IC1.1 38.73,36.83 41.59,36.83 R13.2
  Bottom 0.254: IC1.1 34.29,32.38 21.59,32.38 19.05,29.84 19.05,8.26 17.78,6.99 15.88,6.99 JP1.5
PD0
  Top 0.25: 33.02,44.03 33.02,46.67 R14.1 27.3,46.67 Q2.3 | 33.02,50.07 33.02,50.65 Q6.1
  Top 0.254: IC1.2 35.56,41.49 33.02,44.03 33.02,50.07 | 27.55,46.57 Q2.3
PD1  (via drill 0.3)
  Top 0.25: v32.38,50.8 R29.2
  Bottom 0.25: DIS1.28 33.02,50.8 v32.38,50.8
  Bottom 0.254: DIS1.28 33.02,48.26 IC1.3
PD2
  Bottom 0.254: DIS1.29 30.48,48.26 IC1.4
PD3
  Top 0.25: DIS1.30 27.94,50.8 26.04,50.8 24.77,52.07 R26.2
  Bottom 0.254: DIS1.30 27.94,48.26 IC1.5
PD4
  Bottom 0.254: DIS1.31 25.4,48.26 IC1.6
PD5
  Bottom 0.254: DIS1.36 12.7,48.26 IC1.11
PD6  (via drill 0.3)
  Top 0.25: R8.1 5.71,15.24 6.35,14.61 8.89,14.61 10.79,16.51 v10.79,18.41
  Bottom 0.25: v10.79,18.41 8.89,20.32 8.89,33.02 10.16,34.29 IC1.12
PD7
  Bottom 0.25: 6.35,38.73 7.62,37.47 IC1.13
  Bottom 0.254: 6.35,38.73 DIS1.39
V+  (via drill 0.3, 0.4)
  Top 0.406: Q3.C 3.35,62.87 v6.35,62.87 | C15.+ 4.57,41.49 5.08,41.49 4.45,40.85 4.45,40.64 | U3.IN 48.9,33.02 | C5.+ 48.9,33.02 | 48.9,33.02 C6.1 | C7.1 8.89,41.62 | 8.89,41.62 C15.+ | 8.89,41.62 8.89,41.91 U2.IN | v3.81,38.73 3.81,39.37 4.45,40.01 C15.+ | v42.55,25.4 40.95,25.4 R11.1
  Bottom 0.406: U2.IN 10.16,45.72 10.16,52.7 12.06,54.61 12.7,54.61 13.97,55.88 13.97,65.41 | 13.97,65.41 8.89,65.41 v6.35,62.87 | 13.97,65.41 36.83,65.41 43.81,58.42 43.81,51.44 43.18,50.8 43.18,38.73 48.9,33.02 | DIS1.1 v3.81,38.73 | 48.9,33.02 U3.IN | 48.9,33.02 48.9,30.48 43.18,25.4 v42.55,25.4

### Text on the board
tPlace: CC-BY-SA
tNames: 1 | 2 | 3 | Z+ | Z-